# EAGLE design mosfet (EAGLE 6.3)
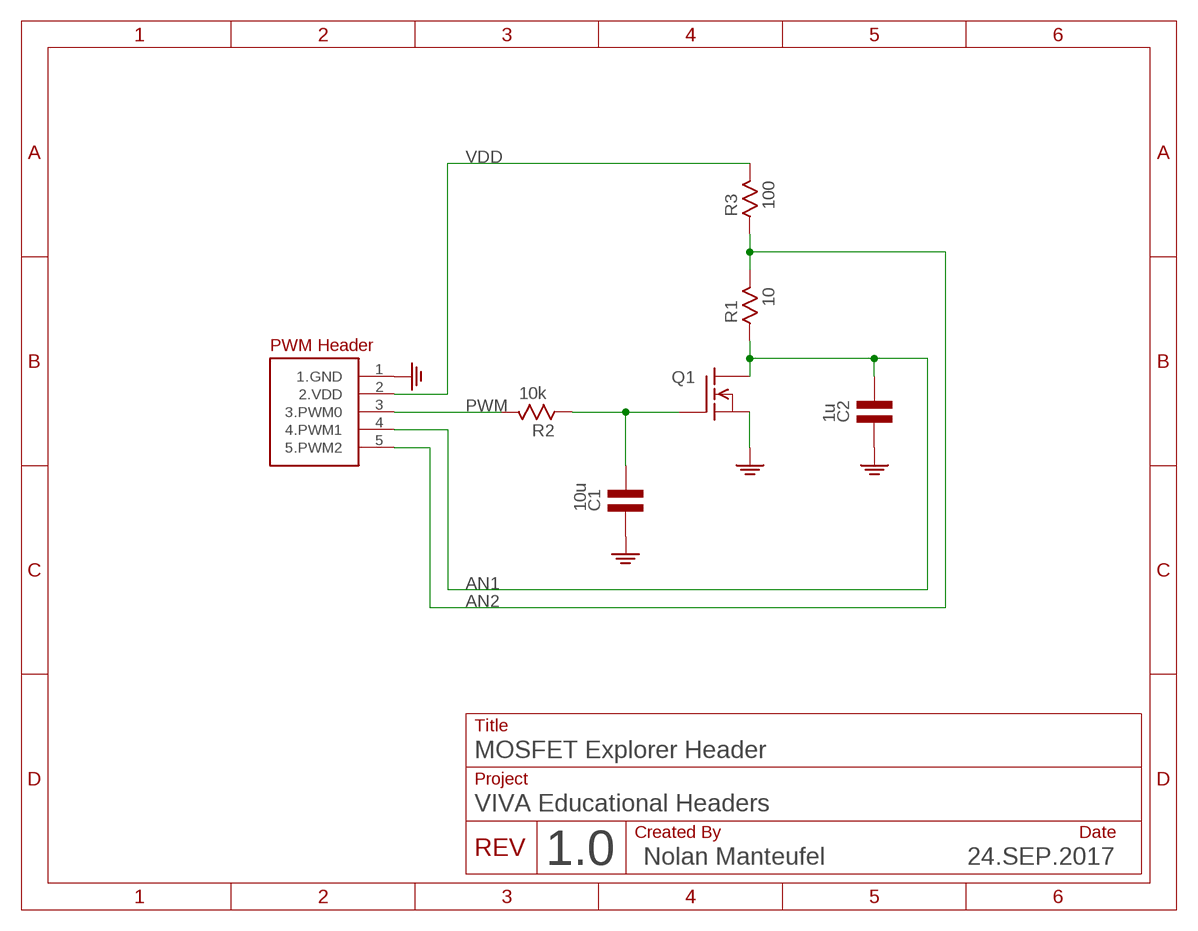
[diagram p0: schematic, sheet 1]

## Parts
C1  10u  C0805  [C0805]
C2  1u  C0805  [C0805]
Q1  N-MOSFETNX7002AK  [SOT23]
R1  10  R0805  [R0805]
R2  10k  R0805  [R0805]
R3  100  R0805  [R0805]
U$1  VIVA-HEADER-PWM-XS  [PINS_5]

## Nets
AN1: C2.2 Q1.3(D) R1.1 U$1.4(4.PWM1)
AN2: C1.2 Q1.1(G) R1.2 R2.1 R3.1 U$1.5(5.PWM2)
GND: C1.1 C2.1 Q1.2(S) U$1.1(1.GND)
PWM: R2.2 U$1.3(3.PWM0)
VDD: R3.2 U$1.2(2.VDD)

## Notes on the sheet
- Title
- MOSFET Explorer Header
- Project
- VIVA Educational Headers
- Created By | Date
- 24.SEP.2017
- REV
- 1.0 | Nolan Manteufel

## Library data of the parts
C1 C2 = nolan-utsa:C
Q1 = nolan-utsa:N-MOSFET
R1-R3 = nolan-utsa:R
U$1 = nolan-utsa:VIVA-HEADER-PWM

## Board
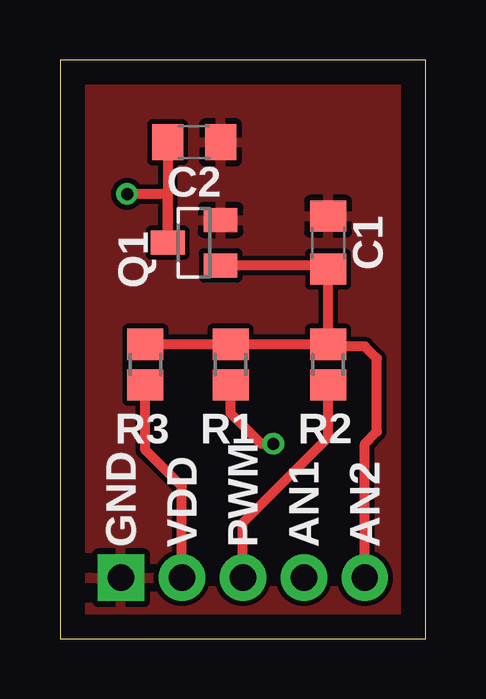
[diagram p1: board, top side]
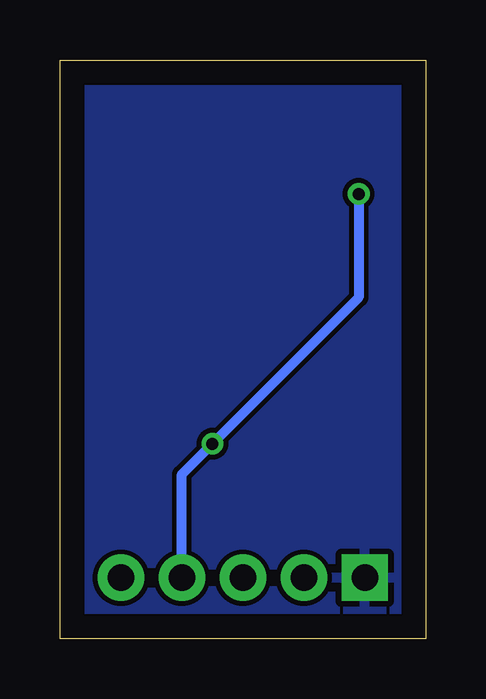
[diagram p2: board, bottom side, seen from below]

Size 15.24 x 24.13 mm. Coordinates in mm from the lower left corner, seen from the top.
Outline: 0,0 15.24,0 15.24,24.13 0,24.13 0,0
Copper layers (1*16): Top 0.035mm / dielectric 1.5mm / Bottom 0.035mm
Design rules "default *": minimum track width 10mil, minimum drill 24mil, track to track 8mil, track to pad 8mil, pad to pad 8mil, via to via 8mil, smd to smd 8mil, copper to edge 40mil, drill to drill 8mil, minimum pad ring 10mil, minimum via ring 8mil, stop-mask expansion 4mil, vias tented up to drill 20mil, thermal gap 10mil

### Footprints (pad centres in the part's own frame; a part is rotated, then mirrored left to right if it is on the bottom)
C0805 = smd 1.3 x 1.5: 1 -1.104,0; 2 1.104,0
SOT23 = smd 1 x 1.4: 1 -0.95,-1.1; 2 0.95,-1.1; 3 0,1.1
R0805 = smd 1.3 x 1.5: 1 -0.85,0; 2 0.85,0
PINS_5 = drill 1.1 pad 1.93 square: 1 0,0 | drill 1.1 pad 1.93: 2 2.54,0; 3 5.08,0; 4 7.62,0; 5 10.16,0

### Placement (x,y rotation side)
C1  11.18,16.51 270 top
C2  5.59,20.7 180 top
Q1  5.59,16.51 90 top
R1  7.11,11.43 90 top
R2  11.18,11.43 270 top
R3  3.56,11.43 270 top
U$1  2.54,2.54 0 top

### Tracks (layer width: path | path; a pad name or v marks a point on that pad's centre or on a via)
AN1  (via drill 0.5)
  Top 0.406: v8.89,8.13 8.38,8.13 7.11,9.4 R1.1 | C2.2 Q1.3 4.49,18.54 v2.79,18.54
  Bottom 0.406: U$1.4 10.16,6.86 v8.89,8.13 2.79,14.22 v2.79,18.54
AN2
  Top 0.406: Q1.1 11.02,15.56 C1.2 R2.1 | R3.1 R1.2 R2.1 | U$1.5 12.7,8.13 13.21,8.64 13.21,11.68 12.7,12.19 11.26,12.19 R2.1
GND
  pour Bottom: 0.51,0.51 14.73,0.51 14.73,23.62 0.51,23.62
  pour Top: 0.51,0.51 14.73,0.51 14.73,23.62 0.51,23.62
PWM
  Top 0.406: U$1.3 7.62,4.83 11.18,8.38 R2.2
VDD
  Top 0.406: U$1.2 5.08,6.35 3.56,7.87 R3.2

### Text on the board
tPlace: GND | VDD | PWM | AN1 | AN2